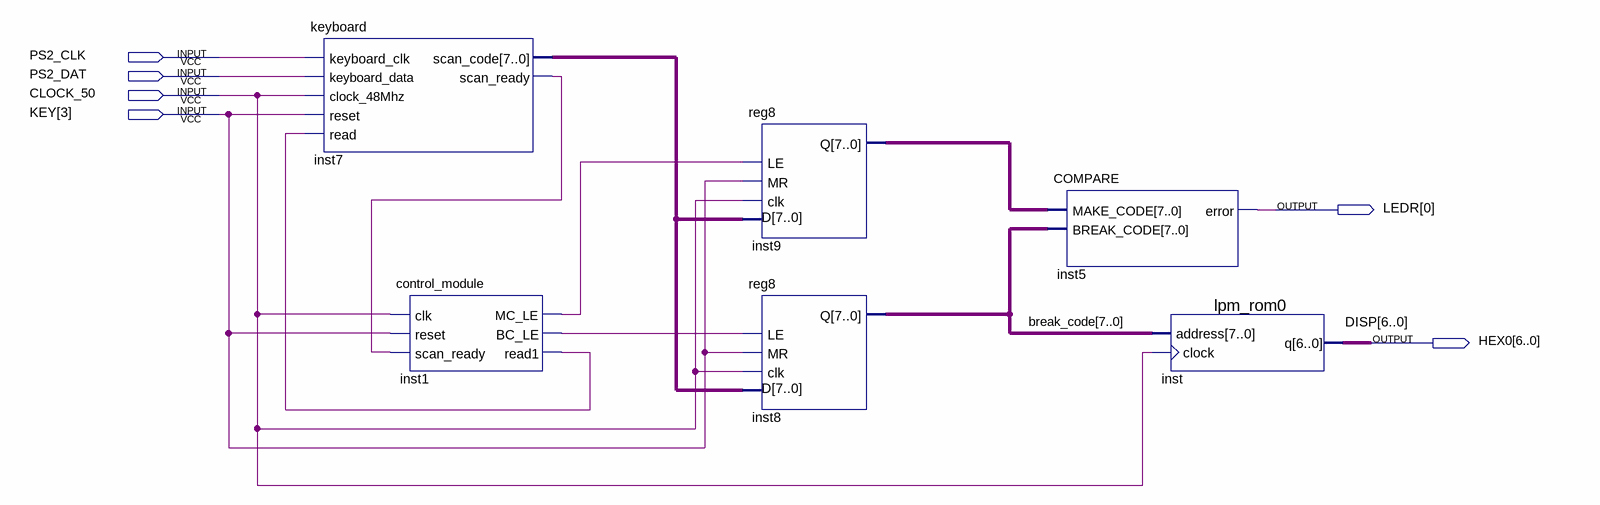
[diagram p0: schematic sheet]
// Quartus schematic convert_and_display.bdf as structural Verilog: 6 symbols, 6 pins
module convert_and_display (
  input  PS2_CLK,
  input  PS2_DAT,
  input  CLOCK_50,
  input  [3:3] KEY,
  output [0:0] LEDR,
  output [6:0] HEX0
);

  wire inst1_bc_le, inst1_mc_le, inst1_read1, inst7_scan_ready;
  wire [7:0] break_code, inst7_scan_code, inst9_q;

  keyboard inst7 (
    .keyboard_clk(PS2_CLK), .keyboard_data(PS2_DAT), .clock_48Mhz(CLOCK_50), .reset(KEY[3]),
    .read(inst1_read1), .scan_code(inst7_scan_code), .scan_ready(inst7_scan_ready));
  control_module inst1 (
    .clk(CLOCK_50), .reset(KEY[3]), .scan_ready(inst7_scan_ready), .MC_LE(inst1_mc_le), .BC_LE(inst1_bc_le),
    .read1(inst1_read1));
  reg8 inst9 (.D(inst7_scan_code), .LE(inst1_mc_le), .MR(KEY[3]), .clk(CLOCK_50), .Q(inst9_q));
  reg8 inst8 (.D(inst7_scan_code), .LE(inst1_bc_le), .MR(KEY[3]), .clk(CLOCK_50), .Q(break_code));
  COMPARE inst5 (.MAKE_CODE(inst9_q), .BREAK_CODE(break_code), .error(LEDR[0]));
  lpm_rom0 inst (.address(break_code), .clock(CLOCK_50), .q(HEX0));

  // Other names for the same wires on the sheet: DISP[6:0] = HEX0
endmodule
